# EAGLE design SparkFun Qwiic Soil Moisture Sensor (EAGLE 9.6.2)
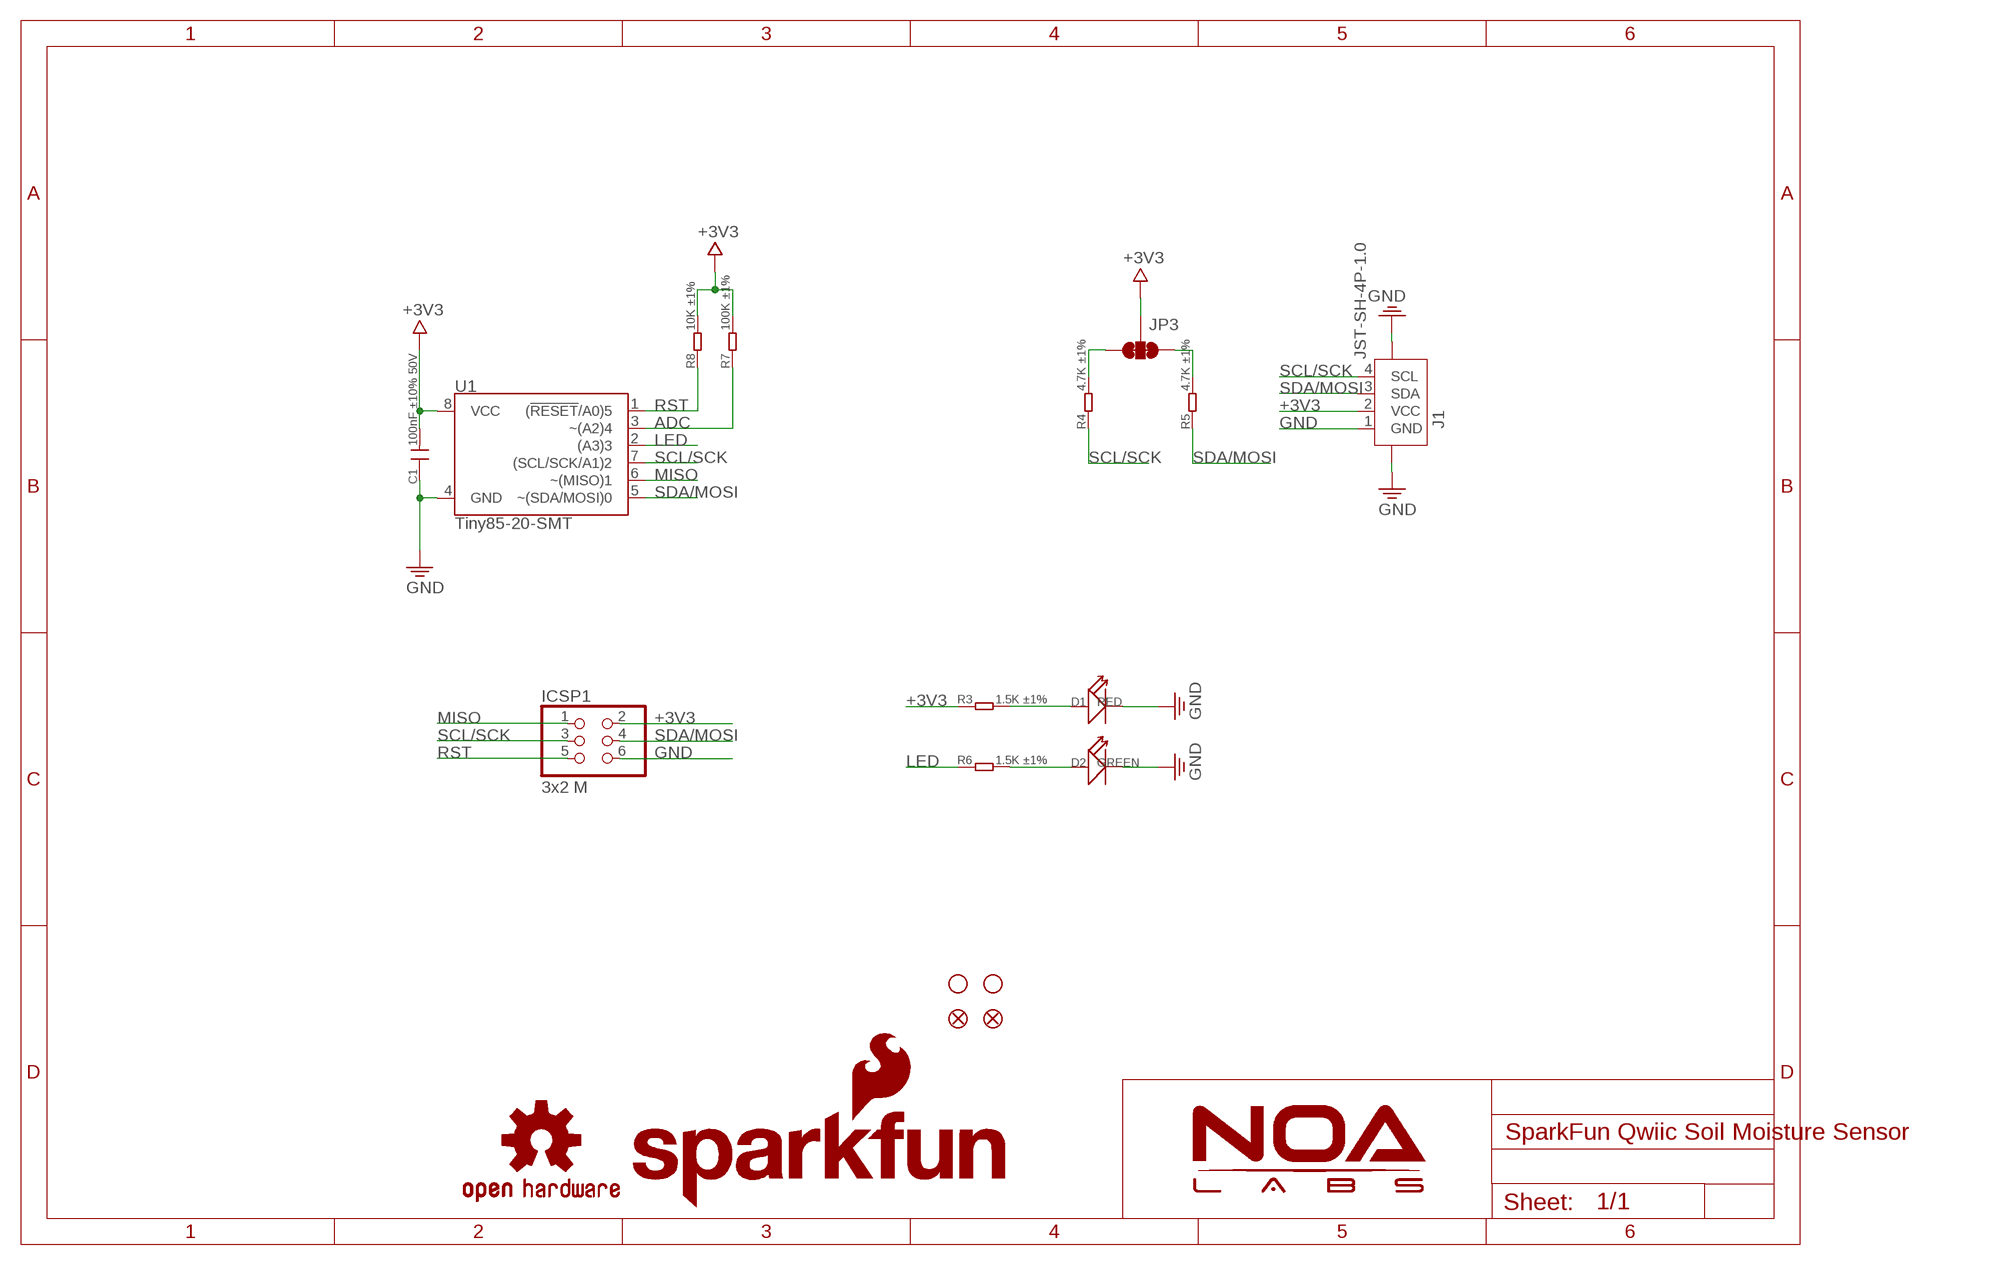
[diagram p0: schematic, sheet 1]

## Parts
C1  100nF ±10% 50V  C-0603  [C0603]
D1  RED  LED'0603'  [LED-0603]
D2  GREEN  LED'0603'  [LED-0603]
FID1  FIDUCIAL1X2  [FIDUCIAL-1X2]
FID2  FIDUCIAL1X2  [FIDUCIAL-1X2]
ICSP1  3x2 M  PINHD-2X3  [2X03]
J1  JST-SH-4P-1.0  [JST-SH-4P]
JP3  SMT-JUMPER_3_2-NC_TRACE  [SMT-JUMPER_3_2-NC_TRACE]
LOGO1  SFE_LOGO_NAME_FLAME.1_INCH  [SFE_LOGO_NAME_FLAME_.1]
LOGO2  OSHW-LOGOS  [OSHW-LOGO-S]
R3  1.5K ±1%  R-0603  [R0603]
R4  4.7K ±1%  R-0603  [R0603]
R5  4.7K ±1%  R-0603  [R0603]
R6  1.5K ±1%  R-0603  [R0603]
R7  100K ±1%  R-0603  [R0603]
R8  10K ±1%  R-0603  [R0603]
STANDOFF1  STAND-OFF  [STAND-OFF]
STANDOFF2  STAND-OFF  [STAND-OFF]
U1  Tiny85-20-SMT  ATTINY85-ARDUINOTINY85-20-SMT  [SO08-EIAJ_MCU]

## Nets
+3V3: C1.2 ICSP1.2 J1.2(VCC) JP3.2 R3.1 R7.2 R8.2 U1.8(VCC)
ADC: R7.1 U1.3(~(A2)4)
GND: C1.1 D1.- D2.- ICSP1.6 J1.1(GND) J1.NC1 J1.NC2 U1.4(GND)
LED: R6.1 U1.2((A3)3)
MISO: ICSP1.1 U1.6(~(MISO)1)
N$1: D1.+ R3.2
N$2: D2.+ R6.2
N$6: JP3.3 R4.2
N$8: JP3.1 R5.2
RST: ICSP1.5 R8.1 U1.1((!RESET!/A0)5)
SCL/SCK: ICSP1.3 J1.4(SCL) R4.1 U1.7((SCL/SCK/A1)2)
SDA/MOSI: ICSP1.4 J1.3(SDA) R5.1 U1.5(~(SDA/MOSI)0)

## Library data of the parts
C1 = RCL:C
D1 D2 = Discrete_NOA:LED*
FID1 FID2 = SparkFun-Aesthetics:FIDUCIAL: Fiducial Alignment Points Various fiducial points for machine vision alignment.
ICSP1 = SmartPrj:PINHD-2X3: PIN HEADER
J1 = Connector:JST-SH-4P
JP3 = NOA-Jumpers:SMT-JUMPER_3_2-NC_TRACE
LOGO1 = SparkFun-Aesthetics:SFE_LOGO_NAME_FLAME: SFE Logo, name and flame This is the SparkFun full logo. The logo on the schematic will always be the same size; the package variant is the height of the flame part of the logo. Default layer for the logo on the board is tSilk.
LOGO2 = SparkFun-Aesthetics:OSHW-LOGO: Open Source Hardware Logo This logo indicates the piece of hardware it is found on incorporates a OSHW license and/or adheres to the definition of open source hardware found here: http://freedomdefined.org/OSHW
R3-R8 = RCL:R
STANDOFF1 STANDOFF2 = SparkFun-Electromechanical:STAND-OFF: #4 Stand Off This is the mechanical footprint for a #4 phillips button head screw. Use the keepout ring to avoid running the screw head into surrounding components. SKU : PRT-00447
U1 = Qwiic-Bluetooth-HC1x:ATTINY85-ARDUINO: Atmel 8-pin 2/4/8kB flash uC; PROD_ID: IC-09092

## Board
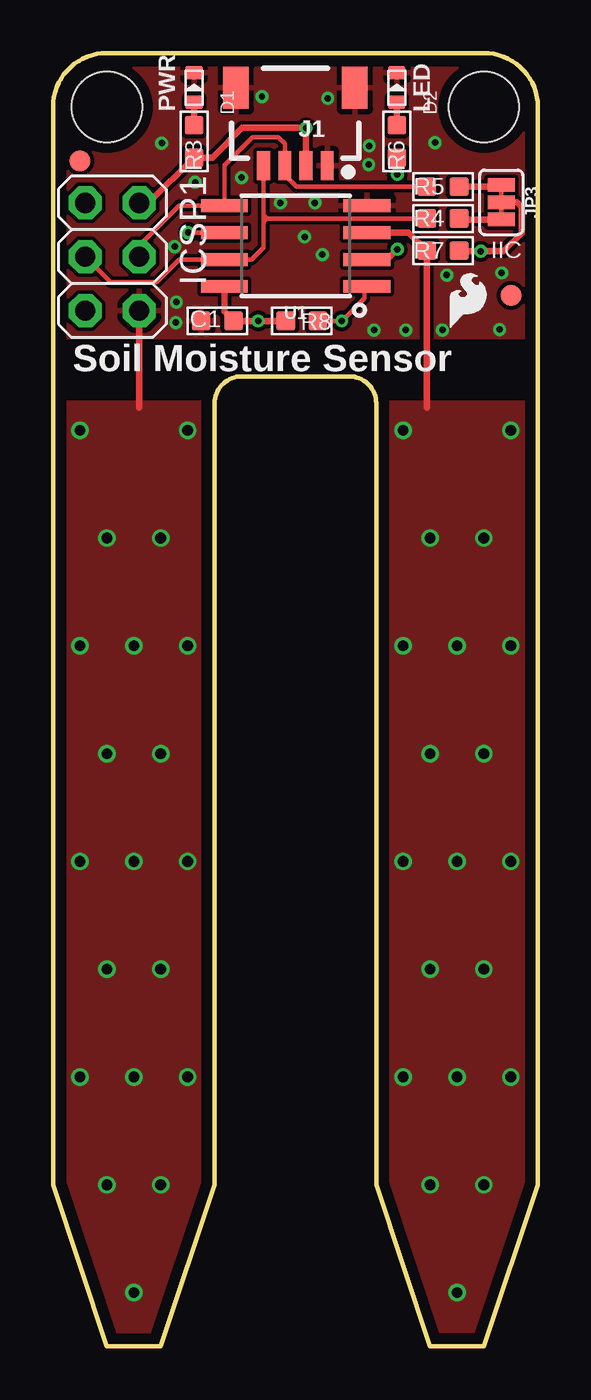
[diagram p1: board, top side]
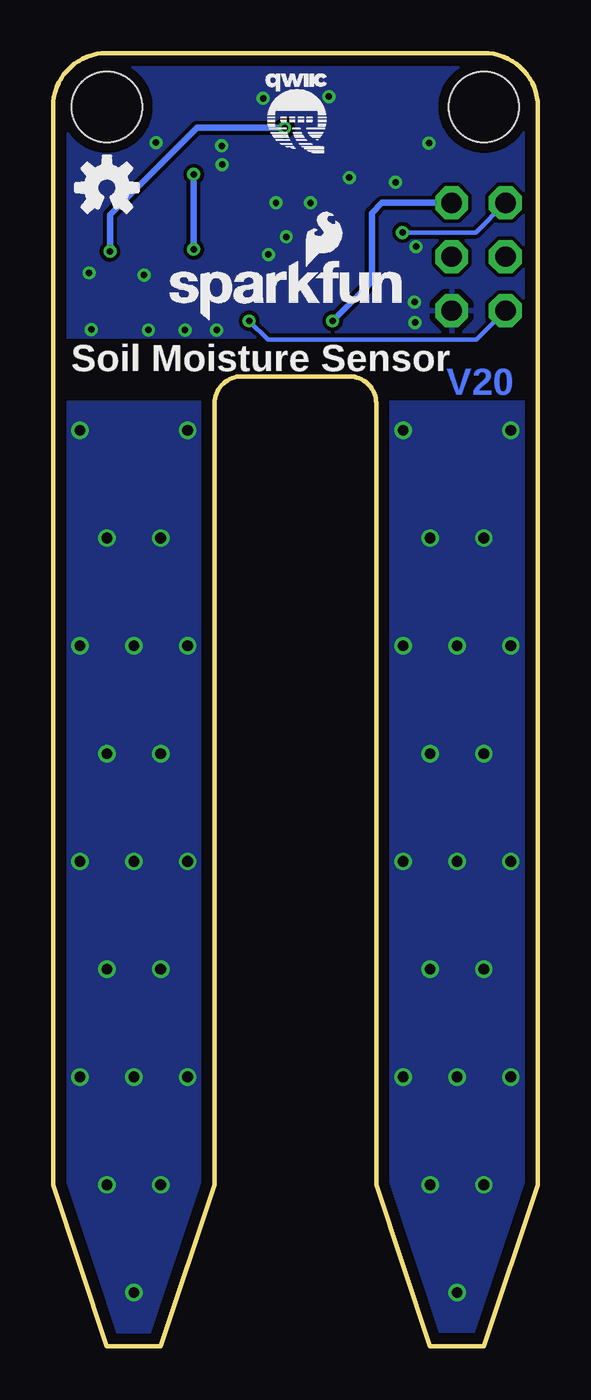
[diagram p2: board, bottom side, seen from below]

Size 22.86 x 60.96 mm. Coordinates in mm from the lower left corner, seen from the top.
Outline: 2.54,60.96 arc90 0,58.42 0,7.62 2.54,0 5.08,0 7.62,7.62 7.62,44.45 arc-90 8.89,45.72 13.97,45.72 arc-90 15.24,44.45 15.24,7.62 17.78,0 20.32,0 22.86,7.62 22.86,58.42 arc90 20.32,60.96 2.54,60.96
Copper layers (1*16): Top 0.035mm / dielectric 1.5mm / Bottom 0.035mm
Design rules "NOA Eagle Rule": minimum track width 7mil, minimum drill 12mil, track to track 7mil, track to pad 7mil, pad to pad 7mil, via to via 7mil, smd to smd 0mil, copper to edge 20mil, drill to drill 10mil, minimum pad ring 10mil, minimum via ring 6mil, stop-mask expansion 2mil, vias tented up to drill 25mil, thermal gap 10mil

### Footprints (pad centres in the part's own frame; a part is rotated, then mirrored left to right if it is on the bottom)
C0603 = smd 0.889 x 0.889: 1 -0.762,0; 2 0.762,0
LED-0603 = smd 0.635 x 0.8: + 0.699,0; - -0.699,0
FIDUCIAL-1X2 = smd 1 x 1: 1 0,0
2X03 = drill 0.95 pad 1.55 octagon: 1 -2.54,-1.27; 2 -2.54,1.27; 3 0,-1.27; 4 0,1.27; 5 2.54,-1.27; 6 2.54,1.27
JST-SH-4P = smd 0.6 x 1.35: 1 1.5,0; 2 0.5,0; 3 -0.5,0; 4 -1.5,0 | smd 1.2 x 2: NC1 -2.8,3.675; NC2 2.8,3.675
SMT-JUMPER_3_2-NC_TRACE = smd 0.635 x 1.27: 1 -0.813,0; 2 0,0; 3 0.813,0
R0603 = smd 0.889 x 0.889: 1 -0.762,0; 2 0.762,0
STAND-OFF = hole 3.302: 0,0
SO08-EIAJ_MCU = smd 0.61 x 2.21: 1 -1.905,-3.378; 2 -0.635,-3.378; 3 0.635,-3.378; 4 1.905,-3.378; 5 1.905,3.353; 6 0.635,3.353; 7 -0.635,3.353; 8 -1.905,3.353

### Placement (x,y rotation side)
C1  7.75,48.34 0 top
D1  6.65,59.33 270 top
D2  16.21,59.33 270 top
FID1  1.27,55.88 0 top
FID2  21.59,49.53 0 top
ICSP1  2.79,51.36 270 top
J1  11.43,55.65 0 top
JP3  21.13,53.92 270 top
LOGO1  17.78,48.26 0 bottom
LOGO2  20.32,54.61 0 bottom
R3  6.65,56.79 90 top
R4  18.39,53.16 0 top
R5  18.39,54.66 0 top
R6  16.21,56.79 90 top
R7  18.39,51.64 0 top
R8  11.73,48.34 180 top
STANDOFF1  2.54,58.42 0 top
STANDOFF2  20.32,58.42 0 top
U1  11.43,51.87 90 top
U$2  [SFE_LOGO_FLAME_.1]  19.56,49.33 0 top
U$5  [QWIIC-LOGO-SMALL]  11.46,58.09 0 bottom

### Tracks (layer width: path | path; a pad name or v marks a point on that pad's centre or on a via)
+3V3  (via drill 0.3)
  Top 0.305: JP3.2 21.87,53.92 22.1,53.7 22.1,52.48 21.23,51.61 v20.17,51.61 19.18,51.61 R7.2 | ICSP1.2 4.51,53.9 R3.1 7.52,56.03 8.91,57.43 11.92,57.43 v11.93,57.42 | J1.2 v11.93,57.42 | v11.93,57.42 v11.94,57.43 | R8.2 v9.68,48.34 C1.2 8.08,48.77 U1.8
  Bottom 0.305: v9.68,48.34 7.82,50.19 7.82,53.42 7.34,53.9 ICSP1.2 | v20.17,51.61 20.17,53.34 16.08,57.43 v11.94,57.43
ADC  (via drill 0.51)
  Top 0.203: 15.04,52.5 U1.3
  Top 0.305: 17.63,44.25 R7.1 16.76,52.5 15.04,52.5
  other vias: 16.51,43.18 21.59,43.18 21.59,33.02 19.05,33.02 16.51,33.02 16.51,22.86 19.05,22.86 21.59,22.86 21.59,12.7 19.05,12.7 16.51,12.7 17.78,7.62 20.32,7.62 19.05,2.54 17.78,38.1 20.32,38.1 20.32,27.94 17.78,27.94 17.78,17.78 20.32,17.78
  pour Top: 15.24,44.45 15.24,0 22.86,0 22.86,44.45
  pour Bottom (isolate 0.305): 15.24,44.45 15.24,0 22.86,0 22.86,44.45
GND  (via drill 0.3, 0.51)
  Top 0.305: ICSP1.6 4.06,44.25
  other vias: 6.35,43.18 1.27,43.18 1.27,33.02 3.81,33.02 6.35,33.02 6.35,22.86 3.81,22.86 1.27,22.86 1.27,12.7 3.81,12.7 6.35,12.7 5.08,7.62 2.54,7.62 3.81,2.54 2.54,17.78 5.08,17.78 2.54,27.94 5.08,27.94 2.54,38.1 5.08,38.1 10.72,53.9 8.89,55.09 14.88,55.7 11.86,52.3 5.79,48.26 21.16,50.6 18.36,47.9 21.06,47.93 14.91,56.59 12.95,58.83 5.13,56.72 18.01,56.74 15.14,47.9 16.64,47.9 5.82,49.23 6.71,54.86 12.34,53.9 12.7,51.46 5.74,51.84 18.57,50.5 9.86,58.9
  pour Top: 0,44.45 0,0 7.62,0 7.62,44.45
  pour Bottom: 0,44.45 0,0 7.62,0 7.62,44.45
  pour Top: 0,47.55 22.86,47.55 22.86,56.26 22.86,60.96 11.2,60.96 0,60.96
  pour Bottom: 0,47.55 22.86,47.55 22.86,60.96 0,60.96
LED  (via drill 0.3)
  Top 0.305: U1.2 15.75,51.23 v16.23,51.71 | v16.23,55.24 16.23,56.01 R6.1
  Bottom 0.305: v16.23,51.71 v16.23,55.24
MISO  (via drill 0.3)
  Top 0.203: U1.6 v6.38,52.5
  Bottom 0.203: v6.38,52.5 2.92,52.5 ICSP1.1
N$1
  Top 0.305: R3.2 D1.+
N$2
  Top 0.305: D2.+ R6.2
N$6
  Top 0.305: R4.2 19.2,53.11 20.32,53.11 JP3.3
N$8
  Top 0.305: JP3.1 21.06,54.66 R5.2
RST  (via drill 0.3)
  Top 0.203: U1.1 14.68,49.96 14.68,49.4 v13.61,48.34 R8.1
  Bottom 0.203: ICSP1.5 2.9,47.45 12.72,47.45 v13.61,48.34
SCL/SCK
  Top 0.203: J1.4 9.93,53.31 | 9.93,53.31 9.93,53.16 | 9.93,53.16 9.93,53.01 | 9.93,53.01 9.93,51.79 9.37,51.23 U1.7 5.94,51.23 4.88,50.16 2.72,50.16 ICSP1.3 | R4.1 10.08,53.16 | 9.93,53.16 10.08,53.16 | 10.08,53.16 9.93,53.31 | 10.08,53.16 9.93,53.01
SDA/MOSI
  Top 0.203: ICSP1.4 4.06,51.89 5.94,53.77 U1.5 8.08,55.68 9.4,57 10.62,57 10.93,56.69 J1.3 10.93,55.21 11.48,54.66 R5.1

### Text on the board
Bottom: V20
tPlace: PWR | LED | IIC | Soil Moisture Sensor
bPlace: Soil Moisture Sensor